# EAGLE schematic main_oled (EAGLE 9.6.2)

## Sheet 1 of 4
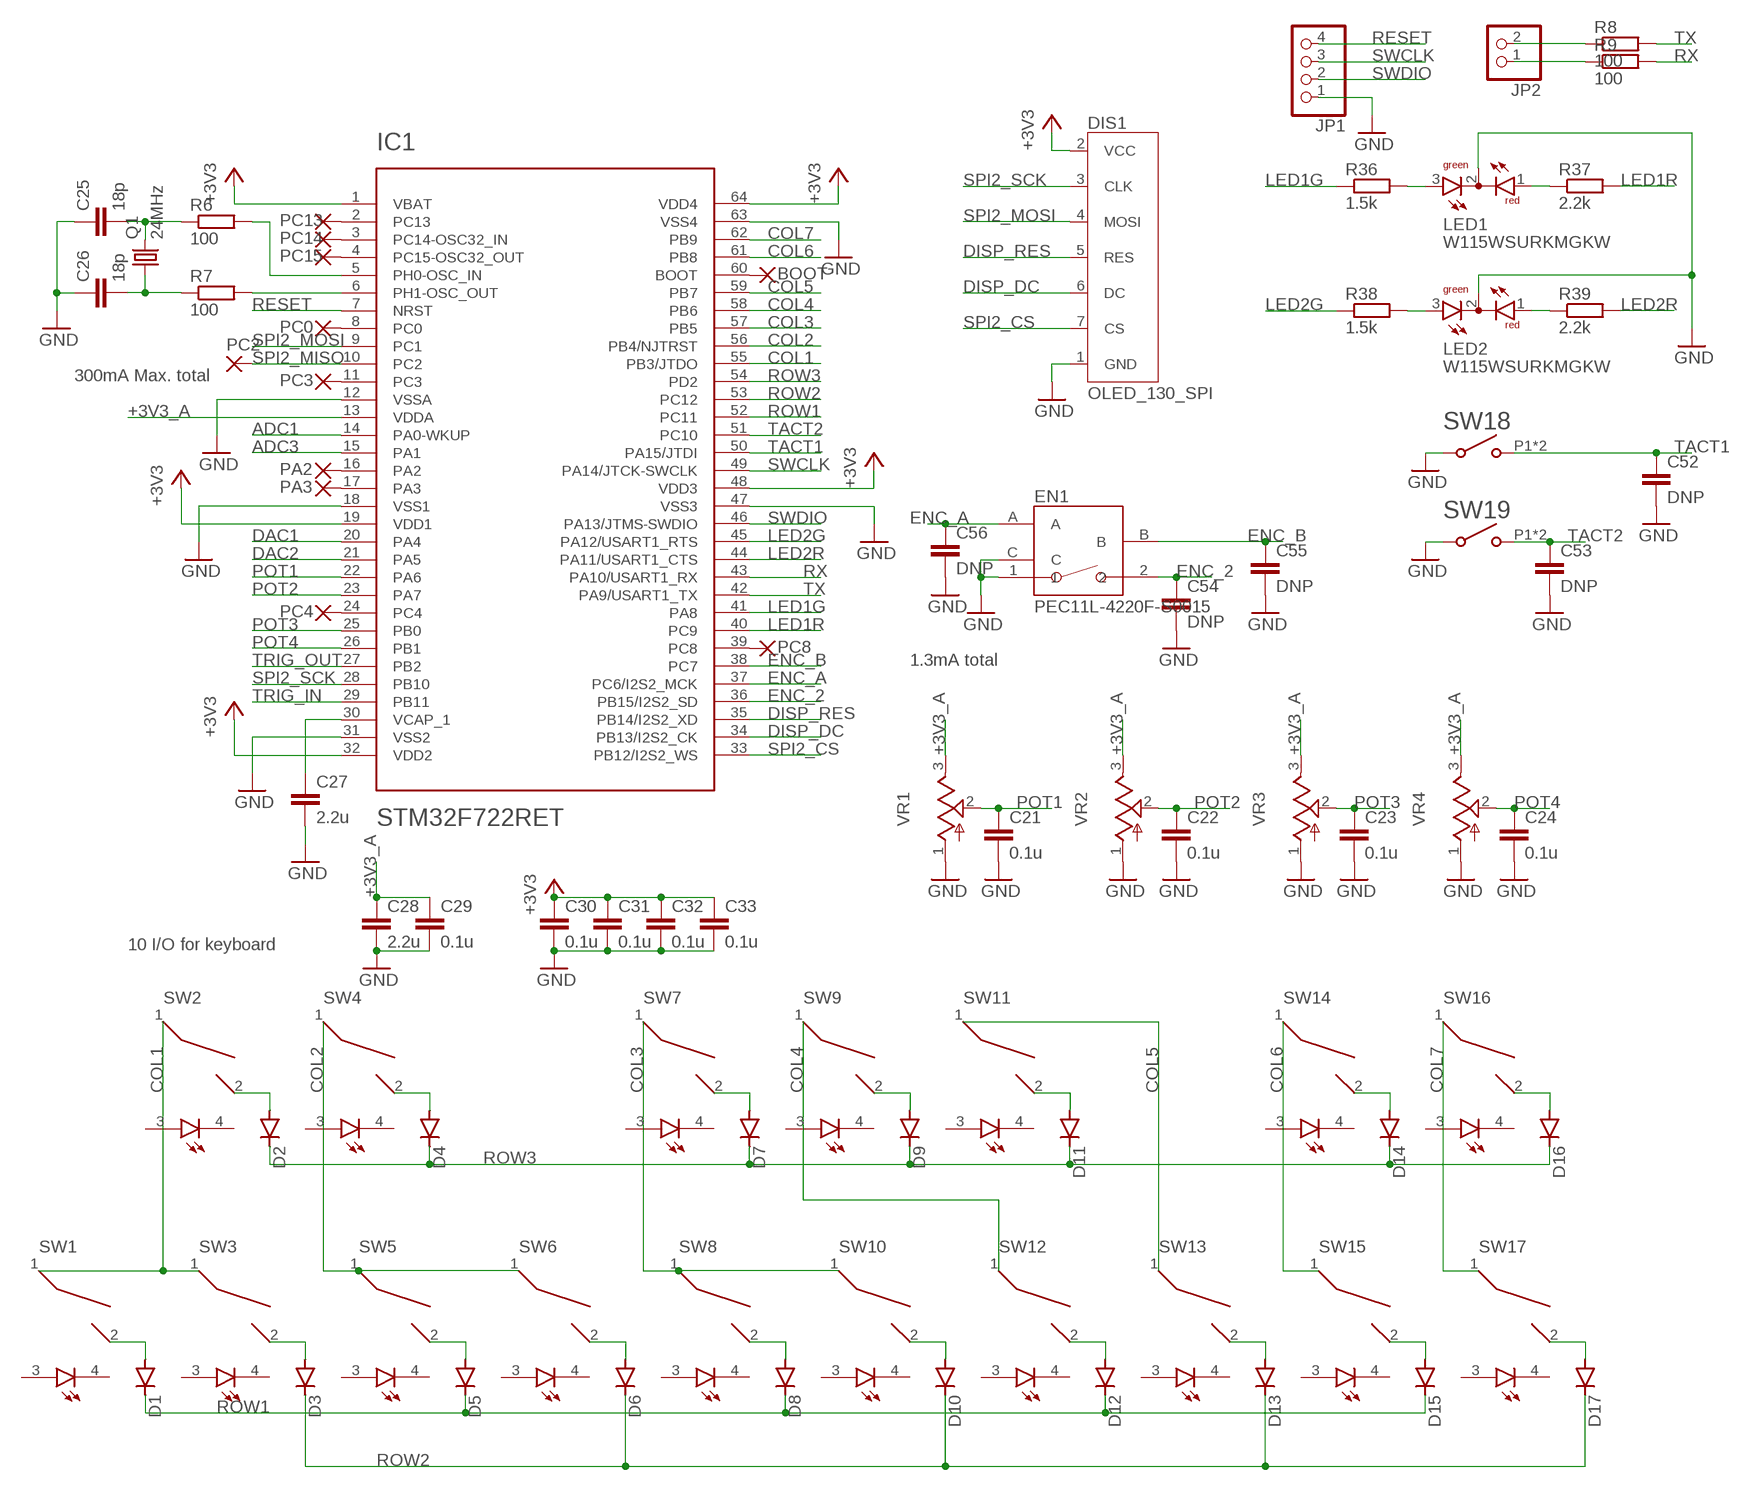
[diagram p0: schematic, sheet 1]

### Parts
BOOT  WIREPAD1,6/0,9  [1,6/0,9]
C21  0.1u  C-EUC0603  [C0603]
C22  0.1u  C-EUC0603  [C0603]
C23  0.1u  C-EUC0603  [C0603]
C24  0.1u  C-EUC0603  [C0603]
C25  18p  C-EUC0603  [C0603]
C26  18p  C-EUC0603  [C0603]
C27  2.2u  C-EUC0805  [C0805]
C28  2.2u  C-EUC0805  [C0805]
C29  0.1u  C-EUC0603  [C0603]
C30  0.1u  C-EUC0603  [C0603]
C31  0.1u  C-EUC0603  [C0603]
C32  0.1u  C-EUC0603  [C0603]
C33  0.1u  C-EUC0603  [C0603]
C52  DNP  C-EUC0603  [C0603]
C53  DNP  C-EUC0603  [C0603]
C54  DNP  C-EUC0603  [C0603]
C55  DNP  C-EUC0603  [C0603]
C56  DNP  C-EUC0603  [C0603]
D1  DIODE-SOD123  [SOD123]
D2  DIODE-SOD123  [SOD123]
D3  DIODE-SOD123  [SOD123]
D4  DIODE-SOD123  [SOD123]
D5  DIODE-SOD123  [SOD123]
D6  DIODE-SOD123  [SOD123]
D7  DIODE-SOD123  [SOD123]
D8  DIODE-SOD123  [SOD123]
D9  DIODE-SOD123  [SOD123]
D10  DIODE-SOD123  [SOD123]
D11  DIODE-SOD123  [SOD123]
D12  DIODE-SOD123  [SOD123]
D13  DIODE-SOD123  [SOD123]
D14  DIODE-SOD123  [SOD123]
D15  DIODE-SOD123  [SOD123]
D16  DIODE-SOD123  [SOD123]
D17  DIODE-SOD123  [SOD123]
DIS1  OLED_130_SPI  [OLED_130_SPI]
EN1  PEC11L-4220F-S0015  [PEC11L-4220F-S0015]
IC1  STM32F722RET  [TQFP64]
JP1  PINHD-1X4  [1X04]
JP2  PINHD-1X2  [1X02]
LED1  W115WSURKMGKW  [W115WSURKMGKW]
LED2  W115WSURKMGKW  [W115WSURKMGKW]
PA2  WIREPAD1,6/0,9  [1,6/0,9]
PA3  WIREPAD1,6/0,9  [1,6/0,9]
PC0  WIREPAD1,6/0,9  [1,6/0,9]
PC2  WIREPAD1,6/0,9  [1,6/0,9]
PC3  WIREPAD1,6/0,9  [1,6/0,9]
PC4  WIREPAD1,6/0,9  [1,6/0,9]
PC8  WIREPAD1,6/0,9  [1,6/0,9]
PC13  WIREPAD1,6/0,9  [1,6/0,9]
PC14  WIREPAD1,6/0,9  [1,6/0,9]
PC15  WIREPAD1,6/0,9  [1,6/0,9]
Q1  24MHz  CRYSTALHC49UP  [HC49UP]
R6  100  R-EU_R0603  [R0603]
R7  100  R-EU_R0603  [R0603]
R8  100  R-EU_R0603  [R0603]
R9  100  R-EU_R0603  [R0603]
R36  1.5k  R-EU_R0603  [R0603]
R37  2.2k  R-EU_R0603  [R0603]
R38  1.5k  R-EU_R0603  [R0603]
R39  2.2k  R-EU_R0603  [R0603]
SW1  CHERRY_MX_LED_WITH_FIXING_PINS  [MX1A-XX[R/G/Y]W]
SW2  CHERRY_MX_LED_WITH_FIXING_PINS  [MX1A-XX[R/G/Y]W]
SW3  CHERRY_MX_LED_WITH_FIXING_PINS  [MX1A-XX[R/G/Y]W]
SW4  CHERRY_MX_LED_WITH_FIXING_PINS  [MX1A-XX[R/G/Y]W]
SW5  CHERRY_MX_LED_WITH_FIXING_PINS  [MX1A-XX[R/G/Y]W]
SW6  CHERRY_MX_LED_WITH_FIXING_PINS  [MX1A-XX[R/G/Y]W]
SW7  CHERRY_MX_LED_WITH_FIXING_PINS  [MX1A-XX[R/G/Y]W]
SW8  CHERRY_MX_LED_WITH_FIXING_PINS  [MX1A-XX[R/G/Y]W]
SW9  CHERRY_MX_LED_WITH_FIXING_PINS  [MX1A-XX[R/G/Y]W]
SW10  CHERRY_MX_LED_WITH_FIXING_PINS  [MX1A-XX[R/G/Y]W]
SW11  CHERRY_MX_LED_WITH_FIXING_PINS  [MX1A-XX[R/G/Y]W]
SW12  CHERRY_MX_LED_WITH_FIXING_PINS  [MX1A-XX[R/G/Y]W]
SW13  CHERRY_MX_LED_WITH_FIXING_PINS  [MX1A-XX[R/G/Y]W]
SW14  CHERRY_MX_LED_WITH_FIXING_PINS  [MX1A-XX[R/G/Y]W]
SW15  CHERRY_MX_LED_WITH_FIXING_PINS  [MX1A-XX[R/G/Y]W]
SW16  CHERRY_MX_LED_WITH_FIXING_PINS  [MX1A-XX[R/G/Y]W]
SW17  CHERRY_MX_LED_WITH_FIXING_PINS  [MX1A-XX[R/G/Y]W]
SW18  TACT_TH  [TACT_TH]
SW19  TACT_TH  [TACT_TH]
VR1  9MM_V  [9MM_V]
VR2  9MM_V  [9MM_V]
VR3  9MM_V  [9MM_V]
VR4  9MM_V  [9MM_V]

### Nets
+3V3 [VCC]: C30.1 C31.1 C32.1 C33.1 DIS1.2(VCC) IC1.1(VBAT) IC1.19(VDD1) IC1.32(VDD2) IC1.48(VDD3) IC1.64(VDD4) ; also sheet 2,3,4
+3V3_A [VCC]: C28.1 C29.1 IC1.13(VDDA) VR1.3 VR2.3 VR3.3 VR4.3 ; also sheet 2,3,4
ADC1: IC1.14(PA0-WKUP) ; also sheet 2
ADC3: IC1.15(PA1) ; also sheet 2
COL1: IC1.55(PB3/JTDO) SW1.1 SW2.1 SW3.1
COL2: IC1.56(PB4/NJTRST) SW4.1 SW5.1 SW6.1
COL3: IC1.57(PB5) SW7.1 SW8.1 SW10.1
COL4: IC1.58(PB6) SW9.1 SW12.1
COL5: IC1.59(PB7) SW11.1 SW13.1
COL6: IC1.61(PB8) SW14.1 SW15.1
COL7: IC1.62(PB9) SW16.1 SW17.1
DAC1: IC1.20(PA4) ; also sheet 2
DAC2: IC1.21(PA5) ; also sheet 2
DISP_DC: DIS1.6(DC) IC1.34(PB13/I2S2_CK)
DISP_RES: DIS1.5(RES) IC1.35(PB14/I2S2_XD)
ENC_2: C54.1 EN1.2 IC1.36(PB15/I2S2_SD)
ENC_A: C56.1 EN1.A IC1.37(PC6/I2S2_MCK)
ENC_B: C55.1 EN1.B IC1.38(PC7)
GND [GND]: C21.2 C22.2 C23.2 C24.2 C25.1 C26.1 C27.2 C28.2 C29.2 C30.2 C31.2 C32.2 C33.2 C52.2 C53.2 C54.2 C55.2 C56.2 DIS1.1(GND) EN1.1 EN1.C IC1.12(VSSA) IC1.18(VSS1) IC1.31(VSS2) IC1.47(VSS3) IC1.63(VSS4) JP1.1 LED1.2(C) LED2.2(C) SW18.P3 SW18.P4 SW19.P3 SW19.P4 VR1.1 VR2.1 VR3.1 VR4.1 ; also sheet 2,3,4
LED1G: IC1.41(PA8) R36.1
LED1R: IC1.40(PC9) R37.2
LED2G: IC1.45(PA12/USART1_RTS) R38.1
LED2R: IC1.44(PA11/USART1_CTS) R39.2
N$1: LED1.3(AG) R36.2
N$2: LED1.1(AR) R37.1
N$3: LED2.3(AG) R38.2
N$4: LED2.1(AR) R39.1
N$5: IC1.2(PC13) PC13.1(P)
N$6: IC1.3(PC14-OSC32_IN) PC14.1(P)
N$7: IC1.4(PC15-OSC32_OUT) PC15.1(P)
N$8: IC1.8(PC0) PC0.1(P)
N$9: IC1.11(PC3) PC3.1(P)
N$10: D1.A SW1.2
N$11: D2.A SW2.2
N$12: D3.A SW3.2
N$13: D4.A SW4.2
N$14: D5.A SW5.2
N$15: D6.A SW6.2
N$16: D7.A SW7.2
N$17: D8.A SW8.2
N$18: D9.A SW9.2
N$19: D10.A SW10.2
N$20: D11.A SW11.2
N$21: D12.A SW12.2
N$22: D13.A SW13.2
N$23: D14.A SW14.2
N$24: D15.A SW15.2
N$25: D16.A SW16.2
N$26: D17.A SW17.2
N$27: IC1.16(PA2) PA2.1(P)
N$28: JP2.1 R9.1
N$29: JP2.2 R8.1
N$38: IC1.5(PH0-OSC_IN) R6.2
N$39: IC1.6(PH1-OSC_OUT) R7.2
N$40: C25.2 Q1.2 R6.1
N$41: C26.2 Q1.1 R7.1
N$42: C27.1 IC1.30(VCAP_1)
N$69: IC1.17(PA3) PA3.1(P)
N$70: IC1.24(PC4) PC4.1(P)
N$73: IC1.39(PC8) PC8.1(P)
N$74: BOOT.1(P) IC1.60(BOOT)
POT1: C21.1 IC1.22(PA6) VR1.2
POT2: C22.1 IC1.23(PA7) VR2.2
POT3: C23.1 IC1.25(PB0) VR3.2
POT4: C24.1 IC1.26(PB1) VR4.2
RESET: IC1.7(NRST) JP1.4
ROW1: D1.C D5.C D8.C D12.C D15.C IC1.52(PC11)
ROW2: D3.C D6.C D10.C D13.C D17.C IC1.53(PC12)
ROW3: D2.C D4.C D7.C D9.C D11.C D14.C D16.C IC1.54(PD2)
RX: IC1.43(PA10/USART1_RX) R9.2
SPI2_CS: DIS1.7(CS) IC1.33(PB12/I2S2_WS)
SPI2_MISO: IC1.10(PC2) PC2.1(P)
SPI2_MOSI: DIS1.4(MOSI) IC1.9(PC1)
SPI2_SCK: DIS1.3(CLK) IC1.28(PB10)
SWCLK: IC1.49(PA14/JTCK-SWCLK) JP1.3
SWDIO: IC1.46(PA13/JTMS-SWDIO) JP1.2
TACT1: C52.1 IC1.50(PA15/JTDI) SW18.P1 SW18.P2
TACT2: C53.1 IC1.51(PC10) SW19.P1 SW19.P2
TRIG_IN: IC1.29(PB11) ; also sheet 2
TRIG_OUT: IC1.27(PB2) ; also sheet 2
TX: IC1.42(PA9/USART1_TX) R8.2
Unconnected: SW1.3 SW1.4 SW2.3 SW2.4 SW3.3 SW3.4 SW4.3 SW4.4 SW5.3 SW5.4 SW6.3 SW6.4 SW7.3 SW7.4 SW8.3 SW8.4 SW9.3 SW9.4 SW10.3 SW10.4 SW11.3 SW11.4 SW12.3 SW12.4 SW13.3 SW13.4 SW14.3 SW14.4 SW15.3 SW15.4 SW16.3 SW16.4 SW17.3 SW17.4

### Notes on the sheet
- 300mA Max. total
- 1.3mA total
- 10 I/O for keyboard

## Sheet 2 of 4
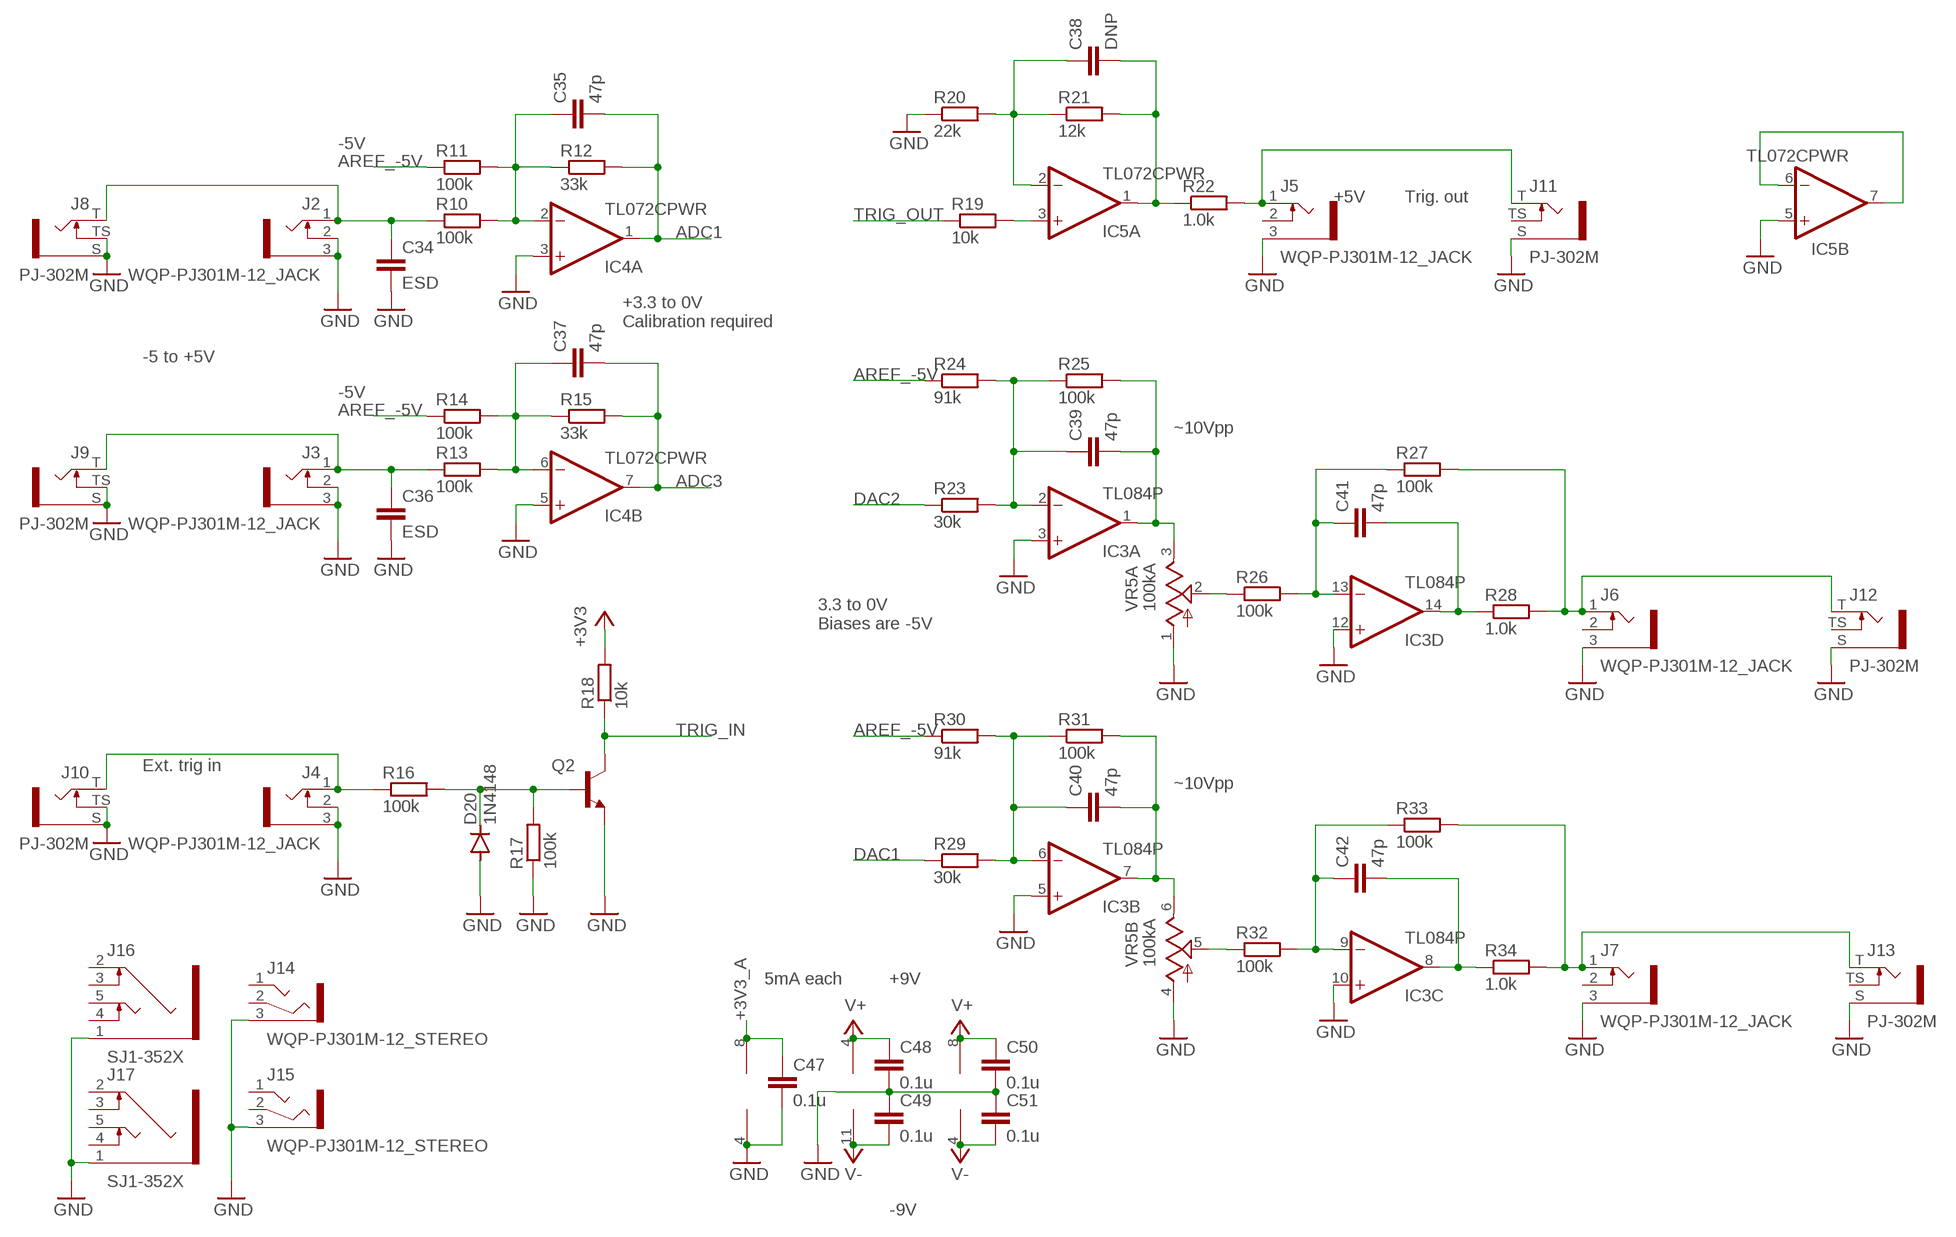
[diagram p1: schematic, sheet 2]

### Parts
C34  ESD  C-EUC0603  [C0603]
C35  47p  C-EUC0603  [C0603]
C36  ESD  C-EUC0603  [C0603]
C37  47p  C-EUC0603  [C0603]
C38  DNP  C-EUC0603  [C0603]
C39  47p  C-EUC0603  [C0603]
C40  47p  C-EUC0603  [C0603]
C41  47p  C-EUC0603  [C0603]
C42  47p  C-EUC0603  [C0603]
C47  0.1u  C-EUC0603  [C0603]
C48  0.1u  C-EUC0603  [C0603]
C49  0.1u  C-EUC0603  [C0603]
C50  0.1u  C-EUC0603  [C0603]
C51  0.1u  C-EUC0603  [C0603]
D20  1N4148  DIODE-SOD123  [SOD123]
IC3  TL084P  [TSSOP14]
IC4  TL072CPWR  [TSSOP8]
IC5  TL072CPWR  [TSSOP8]
J2  WQP-PJ301M-12_JACK  [WQP-PJ301M-12_JACK]
J3  WQP-PJ301M-12_JACK  [WQP-PJ301M-12_JACK]
J4  WQP-PJ301M-12_JACK  [WQP-PJ301M-12_JACK]
J5  WQP-PJ301M-12_JACK  [WQP-PJ301M-12_JACK]
J6  WQP-PJ301M-12_JACK  [WQP-PJ301M-12_JACK]
J7  WQP-PJ301M-12_JACK  [WQP-PJ301M-12_JACK]
J8  PJ-302M  [PJ-302M]
J9  PJ-302M  [PJ-302M]
J10  PJ-302M  [PJ-302M]
J11  PJ-302M  [PJ-302M]
J12  PJ-302M  [PJ-302M]
J13  PJ-302M  [PJ-302M]
J14  WQP-PJ301M-12_STEREO  [WQP-PJ301M-12_JACK]
J15  WQP-PJ301M-12_STEREO  [WQP-PJ301M-12_JACK]
J16  SJ1-352X  [SJ1-352X]
J17  SJ1-352X  [SJ1-352X]
Q2  MMBT3904LT1-NPN-SOT23-BEC  [SOT23-BEC]
R10  100k  R-EU_R0603  [R0603]
R11  100k  R-EU_R0603  [R0603]
R12  33k  R-EU_R0603  [R0603]
R13  100k  R-EU_R0603  [R0603]
R14  100k  R-EU_R0603  [R0603]
R15  33k  R-EU_R0603  [R0603]
R16  100k  R-EU_R0603  [R0603]
R17  100k  R-EU_R0603  [R0603]
R18  10k  R-EU_R0603  [R0603]
R19  10k  R-EU_R0603  [R0603]
R20  22k  R-EU_R0603  [R0603]
R21  12k  R-EU_R0603  [R0603]
R22  1.0k  R-EU_R0603  [R0603]
R23  30k  R-EU_R0603  [R0603]
R24  91k  R-EU_R0603  [R0603]
R25  100k  R-EU_R0603  [R0603]
R26  100k  R-EU_R0603  [R0603]
R27  100k  R-EU_R0603  [R0603]
R28  1.0k  R-EU_R0603  [R0603]
R29  30k  R-EU_R0603  [R0603]
R30  91k  R-EU_R0603  [R0603]
R31  100k  R-EU_R0603  [R0603]
R32  100k  R-EU_R0603  [R0603]
R33  100k  R-EU_R0603  [R0603]
R34  1.0k  R-EU_R0603  [R0603]
VR5  100kA  9MM_V_DUAL  [9MM_V_DUAL]

### Nets
+3V3 [VCC]: R18.2 ; also sheet 1,3,4
+3V3_A [VCC]: C47.1 IC4.8(V+) ; also sheet 1,3,4
ADC1: C35.2 IC4.1(A:OUT) R12.2 ; also sheet 1
ADC3: C37.2 IC4.7(B:OUT) R15.2 ; also sheet 1
AREF_-5V: R11.1 R14.1 R24.1 R30.1 ; also sheet 3,4
DAC1: R29.1 ; also sheet 1
DAC2: R23.1 ; also sheet 1
GND [GND]: C34.2 C36.2 C47.2 C48.2 C49.1 C50.2 C51.1 D20.A IC3.3(A:+IN) IC3.5(B:+IN) IC3.10(C:+IN) IC3.12(D:+IN) IC4.3(A:+IN) IC4.4(V-) IC4.5(B:+IN) IC5.5(B:+IN) J2.2 J2.3 J3.2 J3.3 J4.2 J4.3 J5.3 J6.3 J7.3 J8.S J8.TS J9.S J9.TS J10.S J10.TS J11.S J12.S J13.S J14.3 J15.3 J16.1(S) J17.1(S) Q2.E R17.1 R20.1 VR5.1 VR5.4 ; also sheet 1,3,4
N$43: C34.1 J2.1 J8.T R10.1
N$44: C35.1 IC4.2(A:-IN) R10.2 R11.2 R12.1
N$45: J4.1 J10.T R16.1
N$46: C36.1 J3.1 J9.T R13.1
N$47: C37.1 IC4.6(B:-IN) R13.2 R14.2 R15.1
N$48: D20.C Q2.B R16.2 R17.2
N$51: R26.1 VR5.2
N$52: C39.1 IC3.2(A:-IN) R23.2 R24.2 R25.1
N$53: J6.1 J12.T R27.2 R28.2
N$54: C41.1 IC3.13(D:-IN) R26.2 R27.1
N$55: C40.1 IC3.6(B:-IN) R29.2 R30.2 R31.1
N$56: C41.2 IC3.14(D:OUT) R28.1
N$57: R32.1 VR5.5
N$58: C38.2 IC5.1(A:OUT) R21.2 R22.1
N$59: C39.2 IC3.1(A:OUT) R25.2 VR5.3
N$60: C40.2 IC3.7(B:OUT) R31.2 VR5.6
N$61: C42.1 IC3.9(C:-IN) R32.2 R33.1
N$62: C42.2 IC3.8(C:OUT) R34.1
N$63: J7.1 J13.T R33.2 R34.2
N$64: C38.1 IC5.2(A:-IN) R20.2 R21.1
N$65: IC5.3(A:+IN) R19.2
N$66: J5.1 J11.T R22.2
N$71: IC5.6(B:-IN) IC5.7(B:OUT)
TRIG_IN: Q2.C R18.1 ; also sheet 1
TRIG_OUT: R19.1 ; also sheet 1
V+ [VCC]: C48.1 C50.1 IC3.4(V+) IC5.8(V+) ; also sheet 3,4
V- [VCC]: C49.2 C51.2 IC3.11(V-) IC5.4(V-) ; also sheet 3,4
Unconnected: J5.2 J6.2 J7.2 J11.TS J12.TS J13.TS J14.1 J14.2 J15.1 J15.2 J16.2(R) J16.3(RS) J16.4(TS) J16.5(T) J17.2(R) J17.3(RS) J17.4(TS) J17.5(T)

### Notes on the sheet
- -5V
- +5V | Trig. out
- +3.3 to 0V
  Calibration required
- -5 to +5V
- -5V
- ~10Vpp
- 3.3 to 0V
  Biases are -5V
- Ext. trig in
- ~10Vpp
- 5mA each | +9V
- -9V

## Sheet 3 of 4
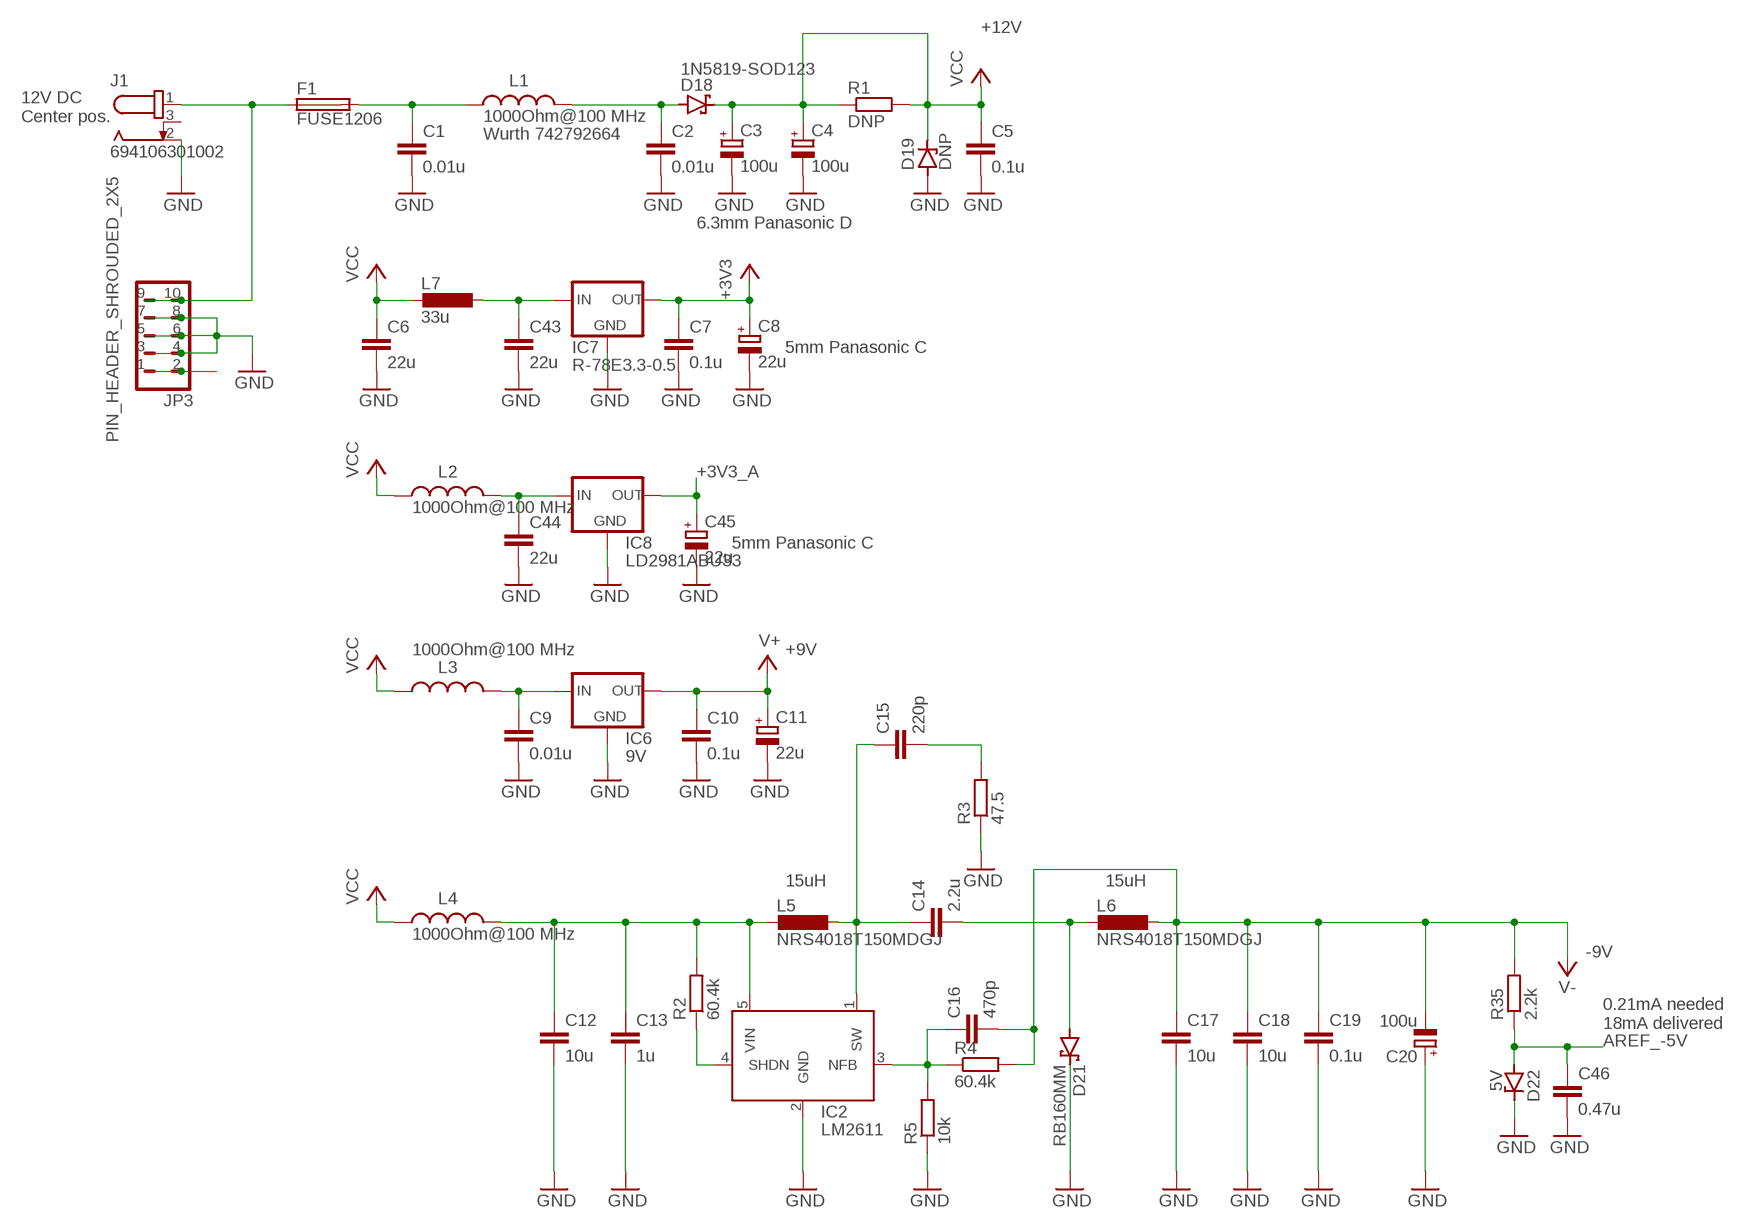
[diagram p2: schematic, sheet 3]

### Parts
C1  0.01u  C-EUC0603  [C0603]
C2  0.01u  C-EUC0603  [C0603]
C3  100u  CPOL-EUD  [PANASONIC_D]
C4  100u  CPOL-EUD  [PANASONIC_D]
C5  0.1u  C-EUC0603  [C0603]
C6  22u  C-EUC1206  [C1206]
C7  0.1u  C-EUC0603  [C0603]
C8  22u  CPOL-EUC  [PANASONIC_C]
C9  0.01u  C-EUC0603  [C0603]
C10  0.1u  C-EUC0603  [C0603]
C11  22u  CPOL-EUC  [PANASONIC_C]
C12  10u  C-EUC0805  [C0805]
C13  1u  C-EUC0805  [C0805]
C14  2.2u  C-EUC0805  [C0805]
C15  220p  C-EUC0603  [C0603]
C16  470p  C-EUC0603  [C0603]
C17  10u  C-EUC0805  [C0805]
C18  10u  C-EUC0805  [C0805]
C19  0.1u  C-EUC0603  [C0603]
C20  100u  CPOL-EUD  [PANASONIC_D]
C43  22u  C-EUC1206  [C1206]
C44  22u  C-EUC1206  [C1206]
C45  22u  CPOL-EUC  [PANASONIC_C]
C46  0.47u  C-EUC0603  [C0603]
D18  1N5819-SOD123  [SOD123]
D19  DNP  ZENER-DIODESOT23  [SOT23]
D21  RB160MM  1N5819-SOD123  [SOD123]
D22  5V  ZENER-DIODESOD123  [SOD123]
F1  FUSE1206  [R1206]
IC2  LM2611  [SOT23-5]
IC6  9V  78XXTO252-3  [TO252-3]
IC7  R-78E3.3-0.5  R-78E-0.5  [R-78E]
IC8  LD2981ABU33  LD2981U  [SOT89R]
J1  694106301002  [694106301002]
JP3  PIN_HEADER_SHROUDED_2X5  [PIN_HEADER_SHROUDED_2X5]
L1  1000Ohm@100 MHz  WE-CBF_0603_742792664_WB_HS  [WE-CBF_0603(W=2.2)]
L2  1000Ohm@100 MHz  WE-CBF_0603_742792664_WB_HS  [WE-CBF_0603(W=2.2)]
L3  1000Ohm@100 MHz  WE-CBF_0603_742792664_WB_HS  [WE-CBF_0603(W=2.2)]
L4  1000Ohm@100 MHz  WE-CBF_0603_742792664_WB_HS  [WE-CBF_0603(W=2.2)]
L5  NRS4018T150MDGJ  NR40XX  [NR40XX]
L6  NRS4018T150MDGJ  NR40XX  [NR40XX]
L7  33u  L-EUL2012C  [L2012C]
R1  DNP  R-EU_R1210  [R1210]
R2  60.4k  R-EU_R0603  [R0603]
R3  47.5  R-EU_R0603  [R0603]
R4  60.4k  R-EU_R0603  [R0603]
R5  10k  R-EU_R0603  [R0603]
R35  2.2k  R-EU_R0603  [R0603]

### Nets
+3V3 [VCC]: C7.1 C8.+ IC7.3(OUT) ; also sheet 1,2,4
+3V3_A [VCC]: C45.+ IC8.2(OUT) ; also sheet 1,2,4
AREF_-5V: C46.1 D22.A R35.1 ; also sheet 2,4
GND [GND]: C1.2 C2.2 C3.- C4.- C5.2 C6.2 C7.2 C8.- C9.2 C10.2 C11.- C12.2 C13.2 C17.2 C18.2 C19.2 C20.+ C43.2 C44.2 C45.- C46.2 D19.1(A) D21.C D22.C IC2.2(GND) IC6.GND IC7.2(GND) IC8.3(GND) IC8.4(GND) J1.2 JP3.3 JP3.4 JP3.5 JP3.6 JP3.7 JP3.8 R3.1 R5.1 ; also sheet 1,2,4
N$30: F1.1 J1.1 JP3.9 JP3.10
N$31: C2.1 D18.A L1.2
N$32: C1.1 F1.2 L1.1
N$33: C12.1 C13.1 IC2.5(VIN) L4.2 L5.2 R2.2
N$34: C14.1 C15.1 IC2.1(SW) L5.1
N$35: IC2.4(SHDN) R2.1
N$36: C15.2 R3.2
N$37: C16.1 IC2.3(NFB) R4.1 R5.2
N$49: C14.2 D21.A L6.2
N$50: C9.1 IC6.IN L3.2
N$67: C43.1 IC7.1(IN) L7.1
N$68: C44.1 IC8.1(IN) L2.2
N$79: JP3.1 JP3.2
V+ [VCC]: C10.1 C11.+ IC6.OUT ; also sheet 2,4
V- [VCC]: C16.2 C17.1 C18.1 C19.1 C20.- L6.1 R4.2 R35.2 ; also sheet 2,4
VCC [VCC]: C3.+ C4.+ C5.1 C6.1 D18.C D19.3(C) L2.1 L3.1 L4.1 L7.2 R1.1 R1.2
Unconnected: J1.3

### Notes on the sheet
- +12V
- 12V DC
  Center pos.
- Wurth 742792664
- 6.3mm Panasonic D
- 5mm Panasonic C
- 5mm Panasonic C
- +9V
- 15uH | 15uH
- -9V
- 0.21mA needed
  18mA delivered

## Sheet 4 of 4
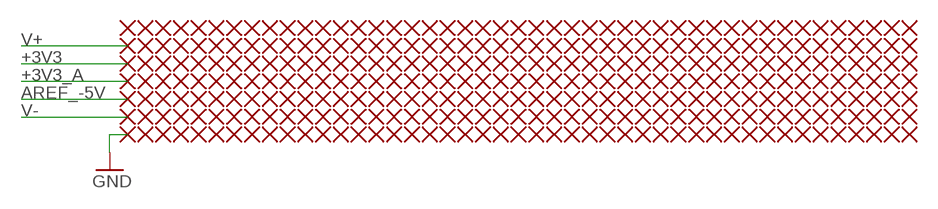
[diagram p3: schematic, sheet 4]

### Parts
P1  PERF_2.54  [PERF_2.54]
P2  PERF_2.54  [PERF_2.54]
P3  PERF_2.54  [PERF_2.54]
P4  PERF_2.54  [PERF_2.54]
P5  PERF_2.54  [PERF_2.54]
P6  PERF_2.54  [PERF_2.54]
P7  PERF_2.54  [PERF_2.54]
P8  PERF_2.54  [PERF_2.54]
P9  PERF_2.54  [PERF_2.54]
P10  PERF_2.54  [PERF_2.54]
P11  PERF_2.54  [PERF_2.54]
P12  PERF_2.54  [PERF_2.54]
P13  PERF_2.54  [PERF_2.54]
P14  PERF_2.54  [PERF_2.54]
P15  PERF_2.54  [PERF_2.54]
P16  PERF_2.54  [PERF_2.54]
P17  PERF_2.54  [PERF_2.54]
P18  PERF_2.54  [PERF_2.54]
P19  PERF_2.54  [PERF_2.54]
P20  PERF_2.54  [PERF_2.54]
P21  PERF_2.54  [PERF_2.54]
P22  PERF_2.54  [PERF_2.54]
P23  PERF_2.54  [PERF_2.54]
P24  PERF_2.54  [PERF_2.54]
P25  PERF_2.54  [PERF_2.54]
P26  PERF_2.54  [PERF_2.54]
P27  PERF_2.54  [PERF_2.54]
P28  PERF_2.54  [PERF_2.54]
P29  PERF_2.54  [PERF_2.54]
P30  PERF_2.54  [PERF_2.54]
P31  PERF_2.54  [PERF_2.54]
P32  PERF_2.54  [PERF_2.54]
P33  PERF_2.54  [PERF_2.54]
P34  PERF_2.54  [PERF_2.54]
P35  PERF_2.54  [PERF_2.54]
P36  PERF_2.54  [PERF_2.54]
P37  PERF_2.54  [PERF_2.54]
P38  PERF_2.54  [PERF_2.54]
P39  PERF_2.54  [PERF_2.54]
P40  PERF_2.54  [PERF_2.54]
P41  PERF_2.54  [PERF_2.54]
P42  PERF_2.54  [PERF_2.54]
P43  PERF_2.54  [PERF_2.54]
P44  PERF_2.54  [PERF_2.54]
P45  PERF_2.54  [PERF_2.54]
P46  PERF_2.54  [PERF_2.54]
P47  PERF_2.54  [PERF_2.54]
P48  PERF_2.54  [PERF_2.54]
P49  PERF_2.54  [PERF_2.54]
P50  PERF_2.54  [PERF_2.54]
P51  PERF_2.54  [PERF_2.54]
P52  PERF_2.54  [PERF_2.54]
P53  PERF_2.54  [PERF_2.54]
P54  PERF_2.54  [PERF_2.54]
P55  PERF_2.54  [PERF_2.54]
P56  PERF_2.54  [PERF_2.54]
P57  PERF_2.54  [PERF_2.54]
P58  PERF_2.54  [PERF_2.54]
P59  PERF_2.54  [PERF_2.54]
P60  PERF_2.54  [PERF_2.54]
P61  PERF_2.54  [PERF_2.54]
P62  PERF_2.54  [PERF_2.54]
P63  PERF_2.54  [PERF_2.54]
P64  PERF_2.54  [PERF_2.54]
P65  PERF_2.54  [PERF_2.54]
P66  PERF_2.54  [PERF_2.54]
P67  PERF_2.54  [PERF_2.54]
P68  PERF_2.54  [PERF_2.54]
P69  PERF_2.54  [PERF_2.54]
P70  PERF_2.54  [PERF_2.54]
P71  PERF_2.54  [PERF_2.54]
P72  PERF_2.54  [PERF_2.54]
P73  PERF_2.54  [PERF_2.54]
P74  PERF_2.54  [PERF_2.54]
P75  PERF_2.54  [PERF_2.54]
P76  PERF_2.54  [PERF_2.54]
P77  PERF_2.54  [PERF_2.54]
P78  PERF_2.54  [PERF_2.54]
P79  PERF_2.54  [PERF_2.54]
P80  PERF_2.54  [PERF_2.54]
P81  PERF_2.54  [PERF_2.54]
P82  PERF_2.54  [PERF_2.54]
P83  PERF_2.54  [PERF_2.54]
P84  PERF_2.54  [PERF_2.54]
P85  PERF_2.54  [PERF_2.54]
P86  PERF_2.54  [PERF_2.54]
P87  PERF_2.54  [PERF_2.54]
P88  PERF_2.54  [PERF_2.54]
P89  PERF_2.54  [PERF_2.54]
P90  PERF_2.54  [PERF_2.54]
P91  PERF_2.54  [PERF_2.54]
P92  PERF_2.54  [PERF_2.54]
P93  PERF_2.54  [PERF_2.54]
P94  PERF_2.54  [PERF_2.54]
P95  PERF_2.54  [PERF_2.54]
P96  PERF_2.54  [PERF_2.54]
P97  PERF_2.54  [PERF_2.54]
P98  PERF_2.54  [PERF_2.54]
P99  PERF_2.54  [PERF_2.54]
P100  PERF_2.54  [PERF_2.54]
P101  PERF_2.54  [PERF_2.54]
P102  PERF_2.54  [PERF_2.54]
P103  PERF_2.54  [PERF_2.54]
P104  PERF_2.54  [PERF_2.54]
P105  PERF_2.54  [PERF_2.54]
P106  PERF_2.54  [PERF_2.54]
P107  PERF_2.54  [PERF_2.54]
P108  PERF_2.54  [PERF_2.54]
P109  PERF_2.54  [PERF_2.54]
P110  PERF_2.54  [PERF_2.54]
P111  PERF_2.54  [PERF_2.54]
P112  PERF_2.54  [PERF_2.54]
P113  PERF_2.54  [PERF_2.54]
P114  PERF_2.54  [PERF_2.54]
P115  PERF_2.54  [PERF_2.54]
P116  PERF_2.54  [PERF_2.54]
P117  PERF_2.54  [PERF_2.54]
P118  PERF_2.54  [PERF_2.54]
P119  PERF_2.54  [PERF_2.54]
P120  PERF_2.54  [PERF_2.54]
P121  PERF_2.54  [PERF_2.54]
P122  PERF_2.54  [PERF_2.54]
P123  PERF_2.54  [PERF_2.54]
P124  PERF_2.54  [PERF_2.54]
P125  PERF_2.54  [PERF_2.54]
P126  PERF_2.54  [PERF_2.54]
P127  PERF_2.54  [PERF_2.54]
P128  PERF_2.54  [PERF_2.54]
P129  PERF_2.54  [PERF_2.54]
P130  PERF_2.54  [PERF_2.54]
P131  PERF_2.54  [PERF_2.54]
P132  PERF_2.54  [PERF_2.54]
P133  PERF_2.54  [PERF_2.54]
P134  PERF_2.54  [PERF_2.54]
P135  PERF_2.54  [PERF_2.54]
P136  PERF_2.54  [PERF_2.54]
P137  PERF_2.54  [PERF_2.54]
P138  PERF_2.54  [PERF_2.54]
P139  PERF_2.54  [PERF_2.54]
P140  PERF_2.54  [PERF_2.54]
P141  PERF_2.54  [PERF_2.54]
P142  PERF_2.54  [PERF_2.54]
P143  PERF_2.54  [PERF_2.54]
P144  PERF_2.54  [PERF_2.54]
P145  PERF_2.54  [PERF_2.54]
P146  PERF_2.54  [PERF_2.54]
P147  PERF_2.54  [PERF_2.54]
P148  PERF_2.54  [PERF_2.54]
P149  PERF_2.54  [PERF_2.54]
P150  PERF_2.54  [PERF_2.54]
P151  PERF_2.54  [PERF_2.54]
P152  PERF_2.54  [PERF_2.54]
P153  PERF_2.54  [PERF_2.54]
P154  PERF_2.54  [PERF_2.54]
P155  PERF_2.54  [PERF_2.54]
P156  PERF_2.54  [PERF_2.54]
P157  PERF_2.54  [PERF_2.54]
P158  PERF_2.54  [PERF_2.54]
P159  PERF_2.54  [PERF_2.54]
P160  PERF_2.54  [PERF_2.54]
P161  PERF_2.54  [PERF_2.54]
P162  PERF_2.54  [PERF_2.54]
P163  PERF_2.54  [PERF_2.54]
P164  PERF_2.54  [PERF_2.54]
P165  PERF_2.54  [PERF_2.54]
P166  PERF_2.54  [PERF_2.54]
P167  PERF_2.54  [PERF_2.54]
P168  PERF_2.54  [PERF_2.54]
P169  PERF_2.54  [PERF_2.54]
P170  PERF_2.54  [PERF_2.54]
P171  PERF_2.54  [PERF_2.54]
P172  PERF_2.54  [PERF_2.54]
P173  PERF_2.54  [PERF_2.54]
P174  PERF_2.54  [PERF_2.54]
P175  PERF_2.54  [PERF_2.54]
P176  PERF_2.54  [PERF_2.54]
P177  PERF_2.54  [PERF_2.54]
P178  PERF_2.54  [PERF_2.54]
P179  PERF_2.54  [PERF_2.54]
P180  PERF_2.54  [PERF_2.54]
P181  PERF_2.54  [PERF_2.54]
P182  PERF_2.54  [PERF_2.54]
P183  PERF_2.54  [PERF_2.54]
P184  PERF_2.54  [PERF_2.54]
P185  PERF_2.54  [PERF_2.54]
P186  PERF_2.54  [PERF_2.54]
P187  PERF_2.54  [PERF_2.54]
P188  PERF_2.54  [PERF_2.54]
P189  PERF_2.54  [PERF_2.54]
P190  PERF_2.54  [PERF_2.54]
P191  PERF_2.54  [PERF_2.54]
P192  PERF_2.54  [PERF_2.54]
P193  PERF_2.54  [PERF_2.54]
P194  PERF_2.54  [PERF_2.54]
P195  PERF_2.54  [PERF_2.54]
P196  PERF_2.54  [PERF_2.54]
P197  PERF_2.54  [PERF_2.54]
P198  PERF_2.54  [PERF_2.54]
P199  PERF_2.54  [PERF_2.54]
P200  PERF_2.54  [PERF_2.54]
P201  PERF_2.54  [PERF_2.54]
P202  PERF_2.54  [PERF_2.54]
P203  PERF_2.54  [PERF_2.54]
P204  PERF_2.54  [PERF_2.54]
P205  PERF_2.54  [PERF_2.54]
P206  PERF_2.54  [PERF_2.54]
P207  PERF_2.54  [PERF_2.54]
P208  PERF_2.54  [PERF_2.54]
P209  PERF_2.54  [PERF_2.54]
P210  PERF_2.54  [PERF_2.54]
P211  PERF_2.54  [PERF_2.54]
P212  PERF_2.54  [PERF_2.54]
P213  PERF_2.54  [PERF_2.54]
P214  PERF_2.54  [PERF_2.54]
P215  PERF_2.54  [PERF_2.54]
P216  PERF_2.54  [PERF_2.54]
P217  PERF_2.54  [PERF_2.54]
P218  PERF_2.54  [PERF_2.54]
P219  PERF_2.54  [PERF_2.54]
P220  PERF_2.54  [PERF_2.54]
P221  PERF_2.54  [PERF_2.54]
P222  PERF_2.54  [PERF_2.54]
P223  PERF_2.54  [PERF_2.54]
P224  PERF_2.54  [PERF_2.54]
P225  PERF_2.54  [PERF_2.54]
P226  PERF_2.54  [PERF_2.54]
P227  PERF_2.54  [PERF_2.54]
P228  PERF_2.54  [PERF_2.54]
P229  PERF_2.54  [PERF_2.54]
P230  PERF_2.54  [PERF_2.54]
P231  PERF_2.54  [PERF_2.54]
P232  PERF_2.54  [PERF_2.54]
P233  PERF_2.54  [PERF_2.54]
P234  PERF_2.54  [PERF_2.54]
P235  PERF_2.54  [PERF_2.54]
P236  PERF_2.54  [PERF_2.54]
P237  PERF_2.54  [PERF_2.54]
P238  PERF_2.54  [PERF_2.54]
P239  PERF_2.54  [PERF_2.54]
P240  PERF_2.54  [PERF_2.54]
P241  PERF_2.54  [PERF_2.54]
P242  PERF_2.54  [PERF_2.54]
P243  PERF_2.54  [PERF_2.54]
P244  PERF_2.54  [PERF_2.54]
P245  PERF_2.54  [PERF_2.54]
P246  PERF_2.54  [PERF_2.54]
P247  PERF_2.54  [PERF_2.54]
P248  PERF_2.54  [PERF_2.54]
P249  PERF_2.54  [PERF_2.54]
P250  PERF_2.54  [PERF_2.54]
P251  PERF_2.54  [PERF_2.54]
P252  PERF_2.54  [PERF_2.54]
P253  PERF_2.54  [PERF_2.54]
P254  PERF_2.54  [PERF_2.54]
P255  PERF_2.54  [PERF_2.54]
P256  PERF_2.54  [PERF_2.54]
P257  PERF_2.54  [PERF_2.54]
P258  PERF_2.54  [PERF_2.54]
P259  PERF_2.54  [PERF_2.54]
P260  PERF_2.54  [PERF_2.54]
P261  PERF_2.54  [PERF_2.54]
P262  PERF_2.54  [PERF_2.54]
P263  PERF_2.54  [PERF_2.54]
P264  PERF_2.54  [PERF_2.54]
P265  PERF_2.54  [PERF_2.54]
P266  PERF_2.54  [PERF_2.54]
P267  PERF_2.54  [PERF_2.54]
P268  PERF_2.54  [PERF_2.54]
P269  PERF_2.54  [PERF_2.54]
P270  PERF_2.54  [PERF_2.54]
P271  PERF_2.54  [PERF_2.54]
P272  PERF_2.54  [PERF_2.54]
P273  PERF_2.54  [PERF_2.54]
P274  PERF_2.54  [PERF_2.54]
P275  PERF_2.54  [PERF_2.54]
P276  PERF_2.54  [PERF_2.54]
P277  PERF_2.54  [PERF_2.54]
P278  PERF_2.54  [PERF_2.54]
P279  PERF_2.54  [PERF_2.54]
P280  PERF_2.54  [PERF_2.54]
P281  PERF_2.54  [PERF_2.54]
P282  PERF_2.54  [PERF_2.54]
P283  PERF_2.54  [PERF_2.54]
P284  PERF_2.54  [PERF_2.54]
P285  PERF_2.54  [PERF_2.54]
P286  PERF_2.54  [PERF_2.54]
P287  PERF_2.54  [PERF_2.54]
P288  PERF_2.54  [PERF_2.54]
P289  PERF_2.54  [PERF_2.54]
P290  PERF_2.54  [PERF_2.54]
P291  PERF_2.54  [PERF_2.54]
P292  PERF_2.54  [PERF_2.54]
P293  PERF_2.54  [PERF_2.54]
P294  PERF_2.54  [PERF_2.54]
P295  PERF_2.54  [PERF_2.54]
P296  PERF_2.54  [PERF_2.54]
P297  PERF_2.54  [PERF_2.54]
P298  PERF_2.54  [PERF_2.54]
P299  PERF_2.54  [PERF_2.54]
P300  PERF_2.54  [PERF_2.54]
P301  PERF_2.54  [PERF_2.54]
P302  PERF_2.54  [PERF_2.54]
P303  PERF_2.54  [PERF_2.54]
P304  PERF_2.54  [PERF_2.54]
P305  PERF_2.54  [PERF_2.54]
P306  PERF_2.54  [PERF_2.54]
P307  PERF_2.54  [PERF_2.54]
P308  PERF_2.54  [PERF_2.54]
P309  PERF_2.54  [PERF_2.54]
P310  PERF_2.54  [PERF_2.54]
P311  PERF_2.54  [PERF_2.54]
P312  PERF_2.54  [PERF_2.54]
P313  PERF_2.54  [PERF_2.54]
P314  PERF_2.54  [PERF_2.54]
P315  PERF_2.54  [PERF_2.54]

### Nets
+3V3 [VCC]: P3.1 ; also sheet 1,2,3
+3V3_A [VCC]: P4.1 ; also sheet 1,2,3
AREF_-5V: P5.1 ; also sheet 2,3
GND [GND]: P7.1 ; also sheet 1,2,3
V+ [VCC]: P2.1 ; also sheet 2,3
V- [VCC]: P6.1 ; also sheet 2,3
Unconnected: P1.1 P8.1 P9.1 P10.1 P11.1 P12.1 P13.1 P14.1 P15.1 P16.1 P17.1 P18.1 P19.1 P20.1 P21.1 P22.1 P23.1 P24.1 P25.1 P26.1 P27.1 P28.1 P29.1 P30.1 P31.1 P32.1 P33.1 P34.1 P35.1 P36.1 P37.1 P38.1 P39.1 P40.1 P41.1 P42.1 P43.1 P44.1 P45.1 P46.1 P47.1 P48.1 P49.1 P50.1 P51.1 P52.1 P53.1 P54.1 P55.1 P56.1 P57.1 P58.1 P59.1 P60.1 P61.1 P62.1 P63.1 P64.1 P65.1 P66.1 P67.1 P68.1 P69.1 P70.1 P71.1 P72.1 P73.1 P74.1 P75.1 P76.1 P77.1 P78.1 P79.1 P80.1 P81.1 P82.1 P83.1 P84.1 P85.1 P86.1 P87.1 P88.1 P89.1 P90.1 P91.1 P92.1 P93.1 P94.1 P95.1 P96.1 P97.1 P98.1 P99.1 P100.1 P101.1 P102.1 P103.1 P104.1 P105.1 P106.1 P107.1 P108.1 P109.1 P110.1 P111.1 P112.1 P113.1 P114.1 P115.1 P116.1 P117.1 P118.1 P119.1 P120.1 P121.1 P122.1 P123.1 P124.1 P125.1 P126.1 P127.1 P128.1 P129.1 P130.1 P131.1 P132.1 P133.1 P134.1 P135.1 P136.1 P137.1 P138.1 P139.1 P140.1 P141.1 P142.1 P143.1 P144.1 P145.1 P146.1 P147.1 P148.1 P149.1 P150.1 P151.1 P152.1 P153.1 P154.1 P155.1 P156.1 P157.1 P158.1 P159.1 P160.1 P161.1 P162.1 P163.1 P164.1 P165.1 P166.1 P167.1 P168.1 P169.1 P170.1 P171.1 P172.1 P173.1 P174.1 P175.1 P176.1 P177.1 P178.1 P179.1 P180.1 P181.1 P182.1 P183.1 P184.1 P185.1 P186.1 P187.1 P188.1 P189.1 P190.1 P191.1 P192.1 P193.1 P194.1 P195.1 P196.1 P197.1 P198.1 P199.1 P200.1 P201.1 P202.1 P203.1 P204.1 P205.1 P206.1 P207.1 P208.1 P209.1 P210.1 P211.1 P212.1 P213.1 P214.1 P215.1 P216.1 P217.1 P218.1 P219.1 P220.1 P221.1 P222.1 P223.1 P224.1 P225.1 P226.1 P227.1 P228.1 P229.1 P230.1 P231.1 P232.1 P233.1 P234.1 P235.1 P236.1 P237.1 P238.1 P239.1 P240.1 P241.1 P242.1 P243.1 P244.1 P245.1 P246.1 P247.1 P248.1 P249.1 P250.1 P251.1 P252.1 P253.1 P254.1 P255.1 P256.1 P257.1 P258.1 P259.1 P260.1 P261.1 P262.1 P263.1 P264.1 P265.1 P266.1 P267.1 P268.1 P269.1 P270.1 P271.1 P272.1 P273.1 P274.1 P275.1 P276.1 P277.1 P278.1 P279.1 P280.1 P281.1 P282.1 P283.1 P284.1 P285.1 P286.1 P287.1 P288.1 P289.1 P290.1 P291.1 P292.1 P293.1 P294.1 P295.1 P296.1 P297.1 P298.1 P299.1 P300.1 P301.1 P302.1 P303.1 P304.1 P305.1 P306.1 P307.1 P308.1 P309.1 P310.1 P311.1 P312.1 P313.1 P314.1 P315.1

## Library data of the parts
BOOT PA2 PA3 PC0 PC2-PC4 PC8 PC13-PC15 = wirepad:WIREPAD: Wire PAD connect wire on PCB
C1 C2 C5-C7 C9 C10 C12-C19 C21-C44 C46-C56 = rcl:C-EU: CAPACITOR, European symbol; SPICEPREFIX: C
C3 C4 C8 C11 C20 C45 = og_cap:CPOL-EU: POLARIZED CAPACITOR, European symbol; SPICEPREFIX: C
D1-D17 = diode:DIODE-: DIODE
D18 D21 = og_diode:1N581*: 1.0A SCHOTTKY BARRIER RECTIFIER Source: http://www.diodes.com/datasheets/ds23001.pdf
D19 D22 = og_diode:ZENER-DIODE: Z-Diode
D20 = og_diode:DIODE-: DIODE
DIS1 = og_display:OLED_130_SPI
EN1 = Encoders:PEC11L-4220F-S0015: ROTARY ENCODER MECHANICAL 15PPR Manufacturer's datasheet <https://www.bourns.com/docs/Product-Datasheets/PEC11L.pdf>; CREATED_BY: PCBLayout.com; DIGIKEY_PARTNO: PEC11L-4220F-S0015-ND; MANUFACTURER: Bourns Inc.; MPN: PEC11L-4220F-S0015
F1 = og_fuse:FUSE: Fuse
IC1 = og_microcontrollers:STM32F722RET
IC2 = og_power:LM2611
IC3 = og_amp:TL084
IC4 IC5 = og_amp:TL072
IC6 = og_v-reg:78XX
IC7 = og_v-reg:R-78E-0.5
IC8 = og_v-reg:LD2981U
J1 = DC Power Jacks:694106301002: CONN PWR JACK 2.1X5.5MM SOLDER Manufacturer's datasheet <https://katalog.we-online.de/em/datasheet/6941xx301002.pdf>; CREATED_BY: PCBLayout.com; DIGIKEY_PART_NUMBER: 732-5930-ND; MANUFACTURER: Wurth Electronics Inc.; MPN: 694106301002
J2-J7 = og_conn:WQP-PJ301M-12_JACK
J8-J13 = og_conn:PJ-302M
J14 J15 = og_conn:WQP-PJ301M-12_STEREO
J16 J17 = og_conn:SJ1-352X
JP1 = pinhead:PINHD-1X4: PIN HEADER
JP2 = pinhead:PINHD-1X2: PIN HEADER
JP3 = og_eurorack:PIN_HEADER_SHROUDED_2X5: 2x5 shrouded pin header for Eurorack power supply.
L1-L4 = Wurth_EMC Components_WE-CBF:WE-CBF_0603: WE-CBF SMD EMI Suppression Ferrite Bead Characteristics Reliable Ni-Sn electrodes High rated current up to 6 A Operating temperature: –55 ºC to +125 ºC Applications Perfect as data lined filter and for uncoupling of distribution voltage Package name and Variant abbreviation: Package: Wide Band /High Speed: W=Width= 2.2 High Current: W=Width= 2.6 Variant abbreviation: WB = Wide Band HS=High Speed HC=High Current <https://www.we-online.com/catalog/media/o14753v209%20Family_WE-CBF.jpg> Details see: https://www.we-online.com/katalog/en/WE-CBF Updated by Ella Wu 2021-1-12 2021(C) Wurth Elektronik; DATASHEET-URL: https://www.we-online.com/catalog/datasheet/742792664.pdf; IR2: 680mA; MOUNT: SMT; PART-NUMBER: 742792664; RDC-MAX: 0.6Ohm; TYPE: High Speed; Z-MAX: 1100Ohm@120 MHz
L5 L6 = og_inductor:NR40XX
L7 = rcl:L-EU: INDUCTOR, European symbol; SPICEPREFIX: L
LED1 LED2 = og_led:W115WSURKMGKW
P1-P315 = og_board:PERF_2.54
Q1 = crystal:CRYSTAL: CRYSTAL; OC_FARNELL: unknown; OC_NEWARK: unknown
Q2 = transistor:*-NPN-: NPN Transistror BF959 corrected 2008.03.06
R1-R39 = rcl:R-EU_: RESISTOR, European symbol; SPICEPREFIX: R
SW1-SW17 = og_cherry_mx:CHERRY_MX_LED
SW18 SW19 = og_sw:TACT_TH
VR1-VR4 = og_pot:9MM_V
VR5 = og_pot:9MM_V_DUAL

## Net classes
0 default: width 0.254 mm
1 GND: width 0.254 mm
2 VCC: width 0.254 mm, drill 0.4 mm